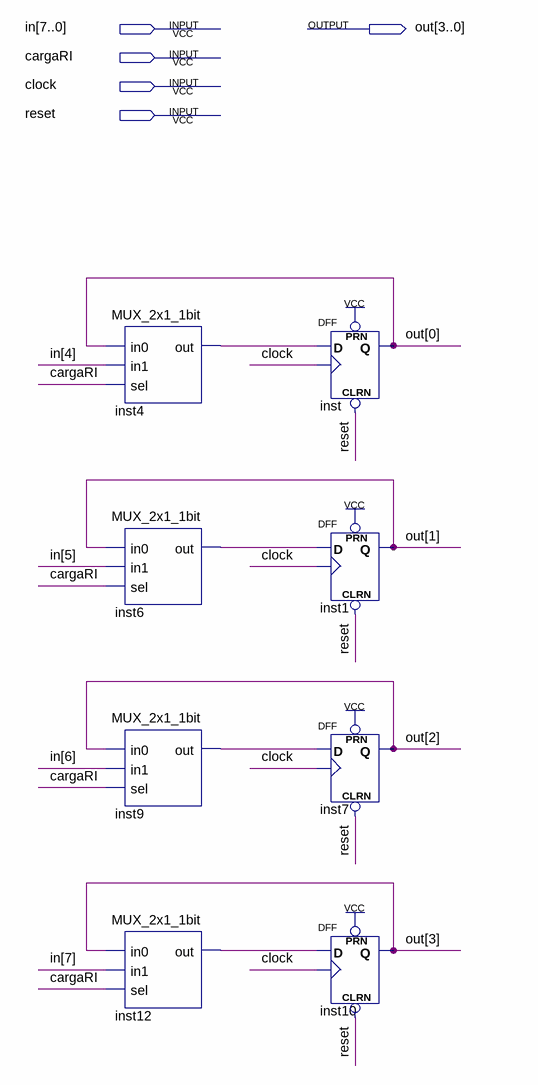
[diagram p0: schematic sheet]
// Quartus schematic InstructionRegister.bdf as structural Verilog: 8 symbols, 5 pins
module InstructionRegister (
  input  [7:0] in,
  input  cargaRI,
  input  clock,
  input  reset,
  output [3:0] out
);

  wire inst4_out, inst6_out, inst9_out, inst12_out;

  MUX_2x1_1bit inst4 (.in0(out[0]), .in1(in[4]), .sel(cargaRI), .out(inst4_out));
  MUX_2x1_1bit inst6 (.in0(out[1]), .in1(in[5]), .sel(cargaRI), .out(inst6_out));
  MUX_2x1_1bit inst9 (.in0(out[2]), .in1(in[6]), .sel(cargaRI), .out(inst9_out));
  MUX_2x1_1bit inst12 (.in0(out[3]), .in1(in[7]), .sel(cargaRI), .out(inst12_out));
  DFF inst (.CLRN(reset), .CLK(clock), .D(inst4_out), .PRN(1'b1), .Q(out[0]));
  DFF inst1 (.CLRN(reset), .CLK(clock), .D(inst6_out), .PRN(1'b1), .Q(out[1]));
  DFF inst7 (.CLRN(reset), .CLK(clock), .D(inst9_out), .PRN(1'b1), .Q(out[2]));
  DFF inst10 (.CLRN(reset), .CLK(clock), .D(inst12_out), .PRN(1'b1), .Q(out[3]));
endmodule
